# Altium schematic sheet Pump.SchDoc
size A4
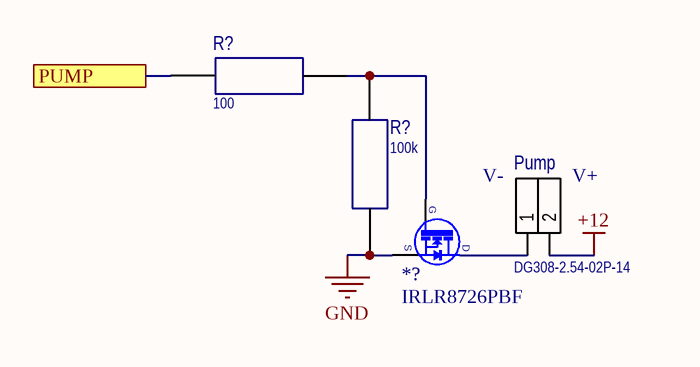
[diagram p0: Pump.SchDoc]

## Parts
(Parts that share a designator on the sheet are numbered #1, #2 ... from top to bottom, then left to right.)
*?  IRLR8726PBF  [IRLR8726PBF]
Pump  DG308-2.54-02P-14  [DG308-2.54-02P-14]
R?#1  100  [R_0805]
R?#2  100k  [R_0805]

## Ports
PUMP

## Nets
+12: Pump.2
GND: *?.3(S) R?#2.1
PUMP: R?#1.2 ; port PUMP
Net*?_2: *?.2(G) R?#1.1 R?#2.2

Not connected (* = marked no-connect by the designer): Pump 1

## Notes on the sheet
- V-
- (near Pump) V+
- (in symbol IRLR8726PBF) D

## Library data of the parts
Pump = DG308-2.54-02P-14: Connector 3Pin 2.54 pitch
R?#1 R?#2 = R0805: Resistor
  R?#1: Value: 100
  R?#2: Value: 100k